# Altium schematic sheet Actuators_Power.SchDoc
size A4; SheetNumber: 4; SheetTotal: 6
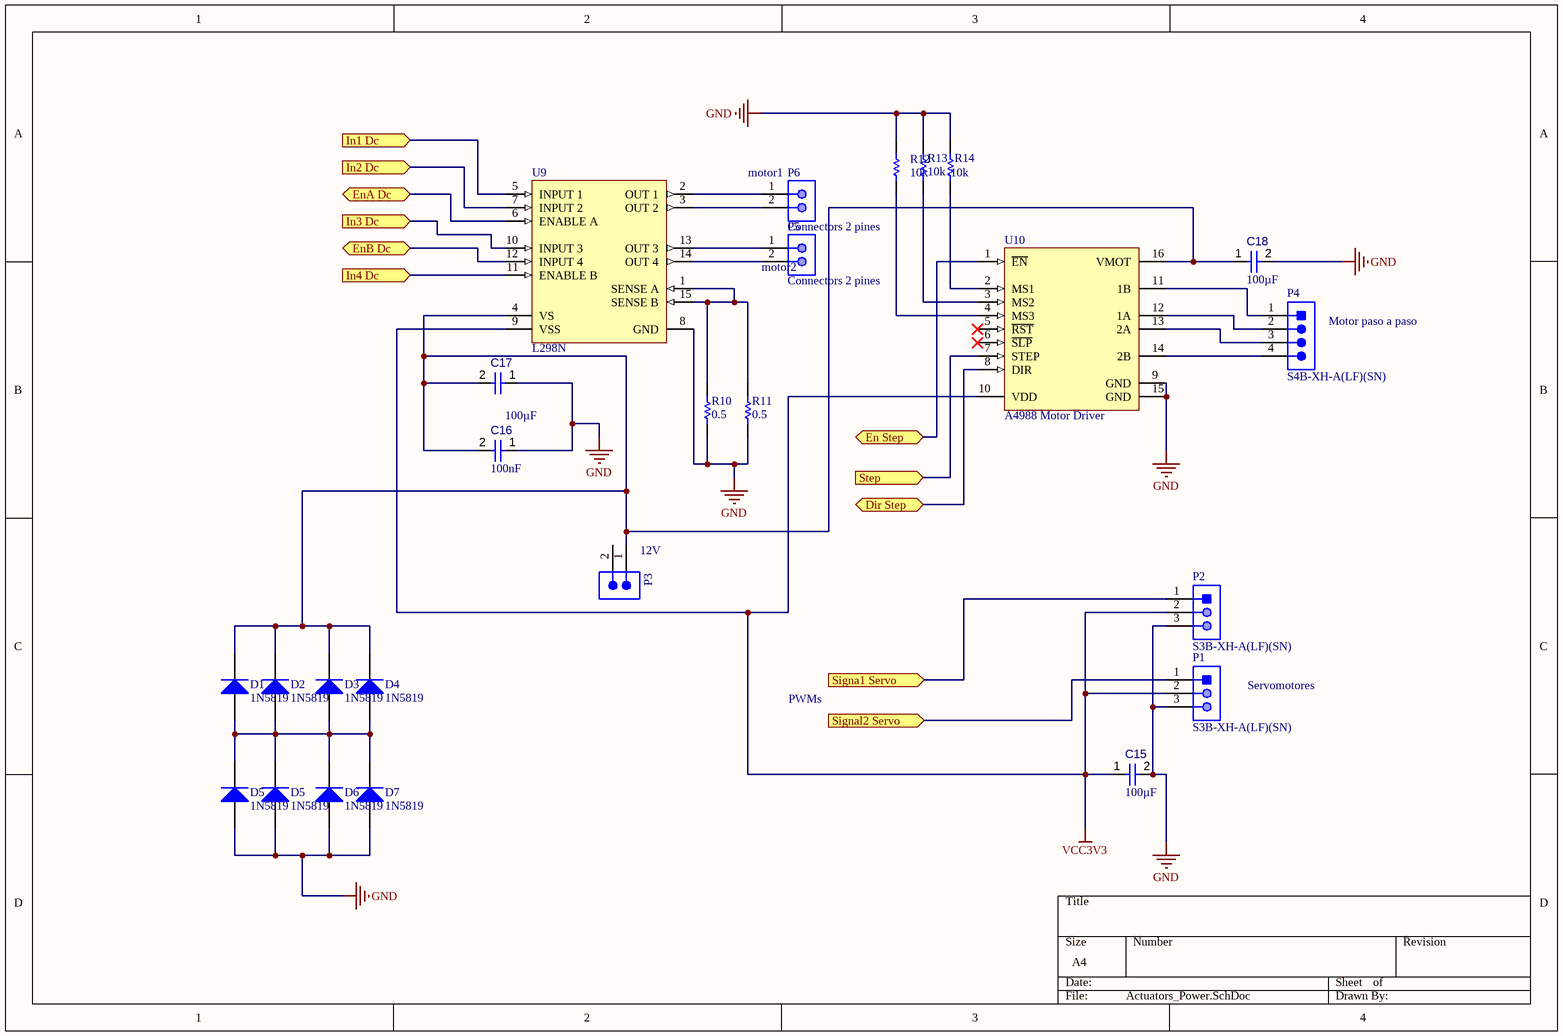
[diagram p0: Actuators_Power.SchDoc]

## Parts
(Parts that share a designator on the sheet are numbered #1, #2 ... from top to bottom, then left to right.)
C15  value 100µF  [CAPC3216X190X55LL30T25]  (hidden comment: Capacitor 100 uF +/- 20% 6.3 V 1206)
C16  value 100nF  [CAPC0402(1005)60_L]  (hidden comment: Capacitor 100nF +/-20% 10V 0402)
C17  value 100µF  [CAPC3216X190X55LL30T25]  (hidden comment: Capacitor 100 uF +/- 20% 6.3 V 1206)
C18  value 100µF  [CAPC3216X190X55LL30T25]  (hidden comment: Capacitor 100 uF +/- 20% 6.3 V 1206)
D1  1N5819  [ONSC-AXIAL_LEAD-2-59-10_P]
D2  1N5819  [ONSC-AXIAL_LEAD-2-59-10_P]
D3  1N5819  [ONSC-AXIAL_LEAD-2-59-10_P]
D4  1N5819  [ONSC-AXIAL_LEAD-2-59-10_P]
D5#1  1N5819  [ONSC-AXIAL_LEAD-2-59-10_P]
D5#2  1N5819  [ONSC-AXIAL_LEAD-2-59-10_P]
D6  1N5819  [ONSC-AXIAL_LEAD-2-59-10_P]
D7  1N5819  [ONSC-AXIAL_LEAD-2-59-10_P]
P1  S3B-XH-A(LF)(SN)  [JST-S3B-XH-A(LF)(SN)_V]
P2  S3B-XH-A(LF)(SN)  [JST-S3B-XH-A(LF)(SN)_V]
P3  691701510002B  [691701510002B]  (value not drawn)
P4  S4B-XH-A(LF)(SN)  [JST-S4B-XH-A(LF)(SN)_V]
P5  Connectors 2 pines  [AMPH-68000-102HLF_V]
P6  Connectors 2 pines  [AMPH-68000-102HLF_V]
R10  value 0.5  [RESC3116X70X50ML13T20]  (hidden comment: Resistor 1k +/-1% 1206 250 mW)
R11  value 0.5  [RESC3116X70X50ML13T20]  (hidden comment: Resistor 1k +/-1% 1206 250 mW)
R12  value 10k  [RESC3116X70X50ML13T20]  (hidden comment: Resistor 1k +/-1% 1206 250 mW)
R13  value 10k  [RESC3116X70X50ML13T20]  (hidden comment: Resistor 1k +/-1% 1206 250 mW)
R14  value 10k  [RESC3116X70X50ML13T20]  (hidden comment: Resistor 1k +/-1% 1206 250 mW)
U9  L298N  [STM-FM-15]
U10  A4988 Motor Driver  [Polo-A4988 Motor Driver_V]

## Ports
Dir Step (bidir), En Step (bidir), EnA Dc (bidir), EnB Dc (bidir), In1 Dc (in), In2 Dc (in), In3 Dc (in), In4 Dc (in), Signa1 Servo (in), Signal2 Servo (in), Step (in)

## Nets
GND: C15.2 C16.1 C17.1 C18.2 D5#1.1(A) D5#2.1(A) D6.1(A) D7.1(A) P1.3 P2.3 R10.1 R11.1 R12.2 R13.2 R14.2 U9.8(GND) U10.9(GND) U10.15(GND)
VCC3V3: C15.1 P1.2 P2.2 U9.9(VSS) U10.10(VDD)
Dir Step: U10.8(DIR) ; port Dir Step
En Step: U10.1(~{EN}) ; port En Step
EnA Dc: U9.6(ENABLE_A) ; port EnA Dc
EnB Dc: U9.12(INPUT_4) ; port EnB Dc
In1 Dc: U9.5(INPUT_1) ; port In1 Dc
In2 Dc: U9.7(INPUT_2) ; port In2 Dc
In3 Dc: U9.10(INPUT_3) ; port In3 Dc
In4 Dc: U9.11(ENABLE_B) ; port In4 Dc
Signa1 Servo: P2.1 ; port Signa1 Servo
Signal2 Servo: P1.1 ; port Signal2 Servo
Step: U10.7(STEP) ; port Step
NetC16_2: C16.2 C17.2 C18.1 D1.2(K) D2.2(K) D3.2(K) D4.2(K) P3.1 U9.4(VS) U10.16(VMOT)
NetD1_1: D1.1(A) D2.1(A) D3.1(A) D4.1(A) D5#1.2(K) D5#2.2(K) D6.2(K) D7.2(K)
NetP4_1: P4.1 U10.11(1B)
NetP4_2: P4.2 U10.12(1A)
NetP4_3: P4.3 U10.13(2A)
NetP4_4: P4.4 U10.14(2B)
NetP5_1: P5.1 U9.13(OUT_3)
NetP5_2: P5.2 U9.14(OUT_4)
NetP6_1: P6.1 U9.2(OUT_1)
NetP6_2: P6.2 U9.3(OUT_2)
NetR10_2: R10.2 R11.2 U9.1(SENSE_A) U9.15(SENSE_B)
NetR12_1: R12.1 U10.4(MS3)
NetR13_1: R13.1 U10.3(MS2)
NetR14_1: R14.1 U10.2(MS1)

Not connected (* = marked no-connect by the designer): P3 2; U10 5(~{RST})* 6(~{SLP})*

## Notes on the sheet
- (near P6) motor1
- (near P5) motor2
- (near P4) Motor paso a paso
- (near P3) 12V
- PWMs
- Servomotores

## Library data of the parts
C15 C17 C18 = CMP-001-00019-6: Chip Capacitor, 100 uF, +/- 20%, 6.3 V, 1206 (3216 Metric); Voltage Rating: 6.3V; Capacitor Type: Ceramic; Tolerance: 20%; Pins: 2; Case/Package: 1206; Max Operating Temperature: 85°C; RoHS Compliant: True; Mounting Technology: SM; Min Operating Temperature: -55°C
C16 = CMP-001-00061-3: Chip Capacitor, 100nF +/-20%, 10V, 0402, Thickness 0.6 mm; Tolerance: 20%; Mounting Technology: SMT; Voltage Rating: 10V; Max Operating Temperature: 85°C; Pins: 2; Case/Package: 0402; Min Operating Temperature: -55°C
D1-D4 D5#1 D5#2 D6 D7 = CMP-004-00009-2: Low Drop Power Schottky Rectifier, 40 V, 1 A, 2-Pin DO-41, RoHS; Manufacturer: ON Semiconductor; Max Surge Current: 25A; Forward Current: 1A; Package Version: Rev. U, 02/2005; Peak Reverse Current: 1mA; Max Operating Temperature: 125°C; Case/Package: DO; Package URL: http://www.onsemi.cn/pub_link/Collateral/59-10.PDF; Packaging: Bulk; Manufacturer URL: http://www.onsemi.com/; Min Operating Temperature: -65°C; Package Description: 2-Pin, Axial Lead, Diameter 2.35 mm; Mounting Technology: TH; Datasheet URL: http://www.onsemi.cn/pub_link/Collateral/1N5817-D.PDF; Datasheet Version: Rev. 10, 07/2006; Package Reference: AXIAL_LEAD-2-59-10; Pins: 2; RoHS Compliant: True
P1 P2 = CMP-002-00033-2: Male Header, Pitch 2.5 mm, 1 x 3 Position, Height 6.1 mm, Tail Length 3.4 mm, -25 to 85 degC, RoHS, Bulk; Manufacturer: JST; Package Description: Male Header, Pitch 2.5 mm, 1 x 3 Position, Height 6.1 mm, Tail Length 3.4 mm; Manufacturer URL: http://www.jst.com/home2.html; Datasheet URL: http://www.jst-mfg.com/product/pdf/eng/eXH.pdf; RoHS Compliant: Unknown; Connector Type: Header; Package Reference: S3B-XH-A(LF)(SN); Gender: Male; Case/Package: S3B-XH-A(LF)(SN); Mounting Technology: TH; Max Operating Temperature: 85°C; Min Operating Temperature: -25°C; Datasheet Version: May-16
P3 = CMP-1502-02329-3: HEADER, 5.08MM, CLOSED SIDED, 2WAY; Connector Type: Terminal Block; Connector Mou; Voltage Rating: 300V; Number of Contacts: 2; Current Rating: 10A; Gender: Male; RoHS: Compliant; Min Operating Temperature: -40°C; Contact Gender: Male; Number of Pins: 2; Contact Material: Brass; Contact Plating: Tin; Termination: PCB; Pitch: 5.08mm; Max Operating Temperature: 105°C; Length: 12.96mm; Color: Black; REACH SVHC: Unknown; Housing Material: Polymer; Mount: Through Hole; Lead Pitch: 5.08mm
P4 = CMP-002-00034-2: Male Header, Pitch 2.5 mm, 1 x 4 Position, Height 6.1 mm, Tail Length 3.4 mm, -25 to 85 degC, RoHS, Bulk; Manufacturer: JST; Manufacturer URL: http://www.jst.com/home2.html; RoHS Compliant: Unknown; Gender: Male; Min Operating Temperature: -25°C; Datasheet URL: http://www.jst-mfg.com/product/pdf/eng/eXH.pdf; Case/Package: S4B-XH-A(LF)(SN); Datasheet Version: May-16; Mounting Technology: TH; Package Reference: S4B-XH-A(LF)(SN); Max Operating Temperature: 85°C; Package Description: XH Series Disconnectable Crimp Style Connector, Pitch 2.5 mm, 1 x 4 Position, Height 6.1 mm, Tail Length 3.4 mm; Connector Type: Header
P5 P6 = CMP-002-00071-1: Pin Header, Board-to-Board, 2.54 mm, 1 Rows, 2 Contacts, Through Hole, FCI BergStik II 68000; Max Voltage Rating (AC): 1.5kV; Plating Thickness: 762nm; Mating Post Length: 5.84mm; Voltage Rating: 110V; Gender: Male; Pitch: 2.54mm; Dielectric Material: Polyethylene; Current Rating: 3A; Number of Contacts: 2; Connector Type: Male Pin; Insulation Resistance: 5GΩ; Lead Length: 2.41mm; Height: 8.7mm; Contact Material: Gold; Contact Plating: Gold; Min Operating Temperature: -65°C; Housing Color: Black; RoHS: Compliant; Packaging: Bulk; Terminal Pitch: 2.54mm; Lifecycle Status: Production; Max Operating Temperature: 125°C; China RoHS: Compliant; REACH SVHC: Yes; Pins: 2; Contact Mating Length: 5.842mm; Introduction Date: 2006-08-30; Depth: 2.41mm; Mounting Technology: Through Hole; Voltage Rating (DC): 1.5kV; Number of Rows: 1; Termination: Solder; Orientation: Straight; Lead Free: Lead Free; Length: 5.08mm; Harmonized Tariff Schedule (HTS) Code: 8536.69.40.40; Contact Gender: Male; Flammability Rating: UL94 V-0; Color: Black; Radiation Hardening: No; Export Control Classification Number (ECCN) Code: EAR99; Lead Pitch: 2.54mm
R10-R14 = CMP-009-00011-5: Chip Resistor, 1 KOhm, +/- 1%, 0.25 W, -55 to 155 degC, 1206 (3216 Metric); Voltage Rating: 200V; Power: 250mW; Max Operating Temperature: 155°C; Mounting Technology: SM; Tolerance: 1%; Case/Package: 1206; RoHS Compliant: True; Min Operating Temperature: -55°C; Pins: 2
U9 = CMP-00024-00007-1: Motor Driver, DC Brush, Full Bridge, 4 Outputs, 4.8V to 46V Supply, 2A Out, Multiwatt-15; Number of Drivers: 2; Drain to Source Resistance: 930mΩ; Interface: Parallel; Operating Supply Current: 13mA; Max Collector Current: 3A; Quiescent Current: 500mA; Max Output current: 4A; Operating Supply Voltage: 5V; Motor Type: Brushed; Min Supply Voltage: 4.5V; Max Supply Voltage: 7V; Number of Outputs: 4; Collector Emitter Voltage (VCEO): 46V; Min Supply Voltage (DC): 4.8V; Lead Free: Lead Free; Lifecycle Status: Production; Height: 10.7mm; Pins: 13; RoHS: Compliant; Number of Circuits: 2; REACH SVHC: No; Min Operating Temperature: -40°C; Output Current per Channel: 2A; Output Voltage: 46V; Number of Terminals: 15; Radiation Hardening: No; Schedule B: 8542390000, 8542390000; Length: 19.6mm; Max Operating Temperature: 150°C; Terminal Pitch: 1.27mm; Number of Transmitters: 2; Mounting Technology: Through Hole; Output Current: 2A; Width: 5mm; Number of Channels: 2; Height - Seated (Max): 21mm; China RoHS: Non-Compliant
U10 = CMP-00024-00002-2: Stepper Motor Driver Carrier, 3 to 5.5 V, 2 A, 16-Pin THD; Manufacturer: Pololu Robotics & Electronics; Datasheet Version: Dec-15; Package Description: 16-Pin Through Hole Device, Body 20.3 x 15.2 mm, Pitch 2.54 mm; Case/Package: A4988MotorDriver; Mounting Technology: TH; RoHS Compliant: Unknown; Datasheet URL: https://www.pololu.com/file/0J1082/a4988-stepper-motor-driver-carrier-dimension-diagram.pdf; Package Reference: A4988 Motor Driver